# Altium schematic sheet SAMD21.SchDoc
size A
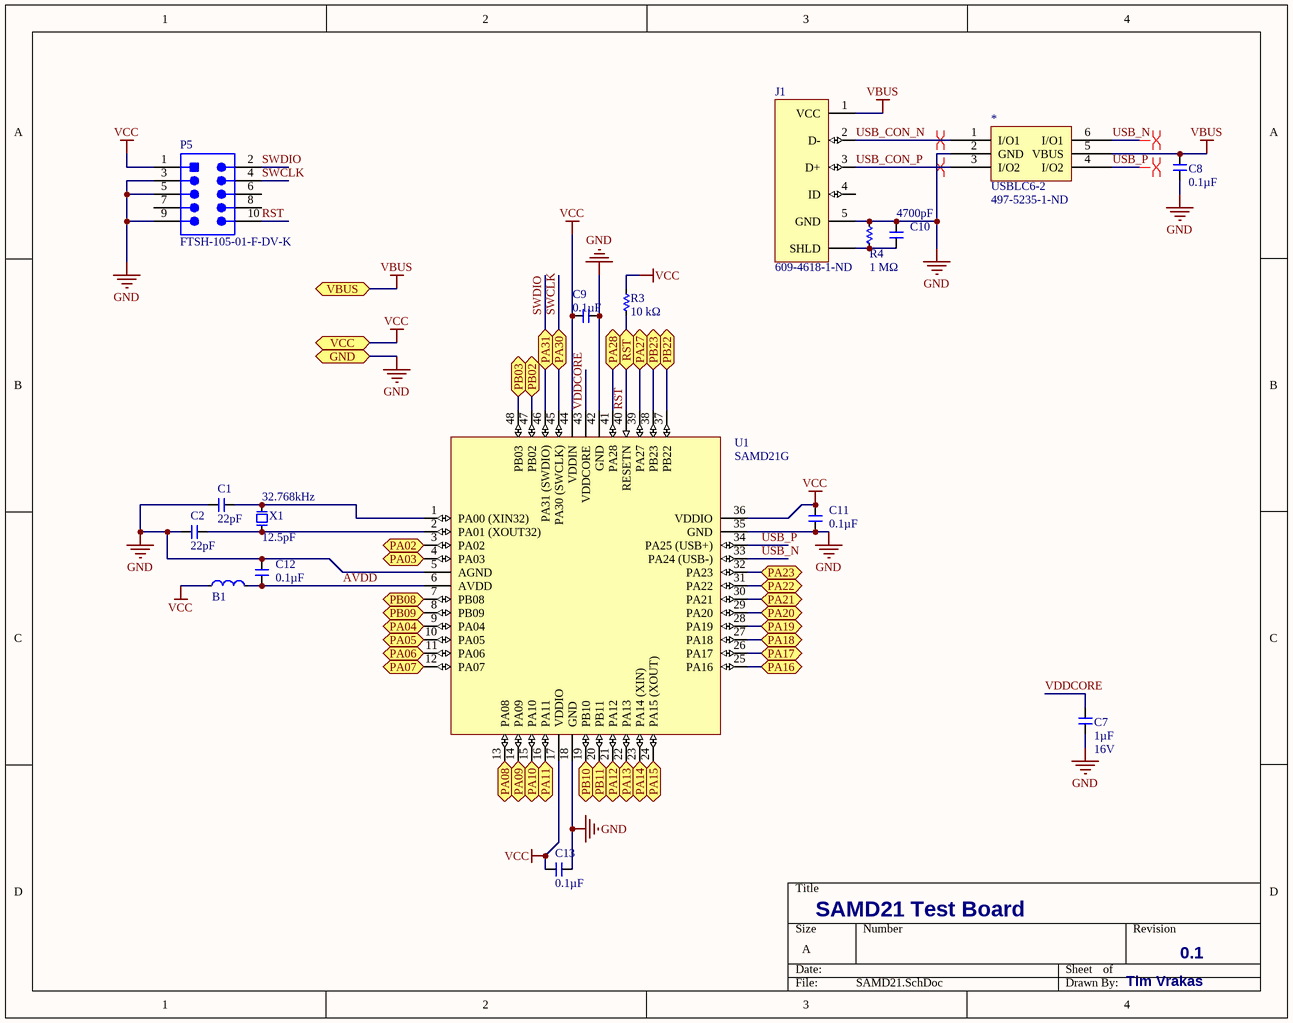
[diagram p0: SAMD21.SchDoc]

## Parts
*  USBLC6-2  Supplier Part Number 1: 497-5235-1-ND  [6SOT23]
B1  FB_1608  [R0603]  (value not drawn)
C1  Capacitance (shorthand): 22pF  [C0603]  (hidden comment: __template_cap)
C2  Capacitance (shorthand): 22pF  [C0603]  (hidden comment: __template_cap)
C7  Capacitance (shorthand): 1µF  Rated Voltage: 16V  [C0603]  (hidden comment: __template_cap)
C8  Capacitance (shorthand): 0.1µF  [C0603]  (hidden comment: __template_cap)
C9  Capacitance (shorthand): 0.1µF  [C0603]  (hidden comment: __template_cap)
C10  Capacitance (shorthand): 4700pF  [C0603]  (hidden comment: __template_cap)
C11  Capacitance (shorthand): 0.1µF  [C0603]  (hidden comment: __template_cap)
C12  Capacitance (shorthand): 0.1µF  [C0603]  (hidden comment: __template_cap)
C13  Capacitance (shorthand): 0.1µF  [C0603]  (hidden comment: __template_cap)
J1  Supplier Part Number 1: 609-4618-1-ND  [CONN_USBMICROB_10118194-0001LF]  (hidden comment: CONN_USB_MICROB_SMD_TH_R/A)
P5  FTSH-105-01-F-DV-K  [SMTC-FTSH-105-01-L-DV-K_V]
R3  Resistance: 10 kΩ  [R0603]  (hidden comment: __template_resistor)
R4  Resistance: 1 MΩ  [R0603]  (hidden comment: __template_resistor)
U1  SAMD21G  [SAMD21 TQFP-48]
X1  Frequency: 32.768kHz  Load Capacitance: 12.5pF  [XTAL_TXC_9HT10]  (hidden comment: XTAL_9HT10-32.768KEZF-T)

## Ports
GND (bidir), PA02 (bidir), PA03 (bidir), PA04 (bidir), PA05 (bidir), PA06 (bidir), PA07 (bidir), PA08 (bidir), PA09 (bidir), PA10 (bidir), PA11 (bidir), PA12 (bidir), PA13 (bidir), PA14 (bidir), PA15 (bidir), PA16 (bidir), PA17 (bidir), PA18 (bidir), PA19 (bidir), PA20 (bidir), PA21 (bidir), PA22 (bidir), PA23 (bidir), PA27 (bidir), PA28 (bidir), PA30 (bidir), PA31 (bidir), PB02 (bidir), PB03 (bidir), PB08 (bidir), PB09 (bidir), PB10 (bidir), PB11 (bidir), PB22 (bidir), PB23 (bidir), RST (bidir), VBUS (bidir), VCC (bidir)

## Nets
GND: *.2(GND) C1.1 C2.1 C7.2 C8.2 C9.1 C10.1 C11.1 C12.1 C13.2 J1.5(GND) P5.3 P5.5 P5.9 R4.2 U1.5(AGND) U1.18(GND) U1.35(GND) U1.42(GND) ; port GND
VBUS: *.5(VBUS) C8.1 J1.1(VCC) ; port VBUS
VCC: B1.1 C9.2 C11.2 C13.1 P5.1 R3.2 U1.17(VDDIO) U1.36(VDDIO) U1.44(VDDIN) ; port VCC
AVDD: B1.2 C12.2 U1.6(AVDD)
PA02: U1.3(PA02) ; port PA02
PA03: U1.4(PA03) ; port PA03
PA04: U1.9(PA04) ; port PA04
PA05: U1.10(PA05) ; port PA05
PA06: U1.11(PA06) ; port PA06
PA07: U1.12(PA07) ; port PA07
PA08: U1.13(PA08) ; port PA08
PA09: U1.14(PA09) ; port PA09
PA10: U1.15(PA10) ; port PA10
PA11: U1.16(PA11) ; port PA11
PA12: U1.21(PA12) ; port PA12
PA13: U1.22(PA13) ; port PA13
PA14: U1.23(PA14_(XIN)) ; port PA14
PA15: U1.24(PA15_(XOUT)) ; port PA15
PA16: U1.25(PA16) ; port PA16
PA17: U1.26(PA17) ; port PA17
PA18: U1.27(PA18) ; port PA18
PA19: U1.28(PA19) ; port PA19
PA20: U1.29(PA20) ; port PA20
PA21: U1.30(PA21) ; port PA21
PA22: U1.31(PA22) ; port PA22
PA23: U1.32(PA23) ; port PA23
PA27: U1.39(PA27) ; port PA27
PA28: U1.41(PA28) ; port PA28
PB02: U1.47(PB02) ; port PB02
PB03: U1.48(PB03) ; port PB03
PB08: U1.7(PB08) ; port PB08
PB09: U1.8(PB09) ; port PB09
PB10: U1.19(PB10) ; port PB10
PB11: U1.20(PB11) ; port PB11
PB22: U1.37(PB22) ; port PB22
PB23: U1.38(PB23) ; port PB23
RST: P5.10 R3.1 U1.40(RESETN) ; port RST
SWCLK: P5.4 U1.45(PA30_(SWCLK)) ; port PA30
SWDIO: P5.2 U1.46(PA31_(SWDIO)) ; port PA31
USB_CON_N: *.1(I/O1) J1.2(D-)
USB_CON_P: *.3(I/O2) J1.3(D+)
USB_N: *.6(I/O1) U1.33(PA24_(USB-))
USB_P: *.4(I/O2) U1.34(PA25_(USB+))
VDDCORE: C7.1 U1.43(VDDCORE)
NetC1_2: C1.2 U1.1(PA00_(XIN32)) X1.2
NetC2_2: C2.2 U1.2(PA01_(XOUT32)) X1.1
NetC10_2: C10.2 J1.SHIELD(SHLD) R4.1

Not connected (* = marked no-connect by the designer): J1 4(ID); P5 6 7 8

## Layout directives
differential pair: USB_CON_N, USB_CON_P, USB_N, USB_P

## Notes on the sheet
- SAMD21 Test Board
- 0.1
- Tim Vrakas

## Library data of the parts
* = USBLC6-2: Manufacturer: STMicroelectronics; Manufacturer Part Number: USBLC6-2SC6; Unidirectional Channels: 2; Voltage - Reverse Standoff (Typ): 5.25V; Voltage - Breakdown (Min): 6V; Voltage - Clamping (Max) @ Ipp: 17V; Current - Peak Pulse (10/1000µs): 5A (8/20µs); Power Line Protection: Yes; Supplier 1: Digi-Key; RoHS: RoHS Compliant; Category: Circuit Protection; Stock 1: 31719; Pricing 1: 1=0.51, 10=0.411, 100=0.2802, 500=0.21012, 1000=0.15759 (USD); Packaging: Cut Tape (CT); Part Status: Active; Type: Steering (Rail to Rail); Bidirectional Channels: -; Power - Peak Pulse: -; Applications: Ethernet; Capacitance @ Frequency: -; Operating Temperature: -40°C ~ 125°C (TJ); Mounting Type: Surface Mount; Package / Case: SOT-23-6; Supplier Device Package: SOT-23-6; ComponentLink1URL: http://www.st.com/web/en/resource/technical/document/datasheet/CD00050750.pdf; ComponentLink1Description: http://www.st.com/web/en/resource/technical/document/datasheet/CD00050750.pdf
B1 = FB_1608: FERRITE BEAD 600 OHM 300mA; Manufacturer: Taiyo Yuden; Manufacturer Part Number: BK1608HW601-T; Number of Lines: 1; Impedance @ Frequency: 600 Ohm @ 100MHz; DC Resistance (DCR) (Max): 400 mOhm; Supplier 1: Digi-Key; Supplier Part Number 1: 587-1879-1-ND; RoHS: RoHS Compliant; Category: Filters; Stock 1: 11908; Pricing 1: 1=0.1, 10=0.059, 50=0.0474, 100=0.0426, 250=0.0312, 500=0.0227, 1000=0.02223 (USD); Packaging: Cut Tape (CT); Part Status: Active; Filter Type: -; Current Rating (Max): 300mA; Ratings: -; Operating Temperature: -55°C ~ 125°C; Package / Case: 0603 (1608 Metric); Mounting Type: Surface Mount; Height (Max): 0.037" (0.95mm); Size / Dimension: 0.063" L x 0.031" W (1.60mm x 0.80mm); ComponentLink1URL: http://ds.yuden.co.jp/TYCOMPAS/ut/detail.do?productNo=BK1608HW601-T&fileName=BK1608HW601-T_SS&mode=specSheetDownload; ComponentLink1Description: http://ds.yuden.co.jp/TYCOMPAS/ut/detail.do?productNo=BK1608HW601-T&fileName=BK1608HW601-T_SS&mode=specSheetDownload
C1 C2 = CAP CER 22PF 50V C0G/NP0 0603
C7 = CAP CER 0603 1µF X7R 16V 10%: Manufacturer: Murata Electronics North America; Capacitance - pF (Machine readable): 1000000; type: capacitor; Dielectric: X7R; Supplier 1: Digikey; Supplier Part Number 1: 490-3900-1-ND
C8 C9 C11-C13 = CAP CER 0603 0.1µF X7R 50V 10%: Manufacturer: Murata Electronics North America; Capacitance - pF (Machine readable): 100000; type: capacitor; Dielectric: X7R; Supplier 1: Digikey; Supplier Part Number 1: 490-1519-1-ND
C10 = CAP CER 0603 4700pF X7R 50V 10%: Manufacturer: Murata Electronics North America; Capacitance - pF (Machine readable): 4700; type: capacitor; Dielectric: X7R; Supplier 1: Digikey; Supplier Part Number 1: 490-1506-1-ND
J1 = CONN_USB_MICROB_SMD_TH_R/A: Through Hole Micro USB Connector; Manufacturer: Amphenol FCI; Manufacturer Part Number: 10118194-0001LF; Gender: Receptacle; Current Rating: 1.8A; Connector Type: USB,Receptacle; Number of Contacts: 5; Insulation Resistance: 1GR; Number of Ports: 1; Max Voltage Rating (AC): 100V; Pitch: 0.65mm; Supplier 1: Digi-Key; Stock 1: 180464; Pricing 1: 1=0.46, 10=0.437, 25=0.3744, 50=0.318, 100=0.3056, 250=0.2744, 500=0.262 (USD); Mount: Surface Mount,Horizontal; Contact Material: Copper Alloy; Contact Plating: Nickel,Gold; Number of Terminals: 5; Housing Material: Polymer; Colour: Black; Min Operating Temperature: -55°C; Max Operating Temperature: 85°C; Package Quantity: 9600; Packaging: Tape and Reel; Termination: Solder; Orientation: Right Angle; Length: 8.05mm; Depth: 5mm; Radiation Hardening: No; Lead Free: Lead Free; Flammability Rating: UL94 V-0; ComponentLink1URL: https://datasheet.ciiva.com/851/10118194-851110.pdf; ComponentLink1Description: https://datasheet.ciiva.com/851/10118194-851110.pdf; ComponentLink2URL: https://datasheet.ciiva.com/851/10118194-851111.pdf; ComponentLink2Description: https://datasheet.ciiva.com/851/10118194-851111.pdf; ComponentLink3URL: https://datasheet.ciiva.com/4598/10118194ac-197217-4598807.pdf; ComponentLink3Description: https://datasheet.ciiva.com/4598/10118194ac-197217-4598807.pdf; ComponentLink4URL: https://datasheet.ciiva.com/29907/10118194-29907230.pdf; ComponentLink4Description: https://datasheet.ciiva.com/29907/10118194-29907230.pdf; ComponentLink5URL: https://datasheet.ciiva.com/26945/getdatasheetpartid-418619-26945695.pdf; ComponentLink5Description: https://datasheet.ciiva.com/26945/getdatasheetpartid-418619-26945695.pdf
P5 = CMP-2000-05352-1: Male Header, Pitch 1.27 mm, 2 x 5 Position, Height 6.12 mm, RoHS, Tube; Manufacturer: Samtec; Number of Positions: 10; Connector Type: Header,Shrouded; Number of Positions Loaded: All; Fastening Type: -; Package Reference: FTSH-105-01-L-DV-K; Termination: Solder; Package URL: http://suddendocs.samtec.com/prints/ftsh-1xx-xx-xxx-dv-xxx-footprint.pdf; Number of Rows: 2; Contact Finish Thickness: 3µin(0.08µm); Contact Type: MalePin; Manufacturer URL: http://www.samtec.com/; Series: FTSH; Features: -; Contact Finish: Gold; Color: Black; Family: RectangularConnectors-Headers,MalePins; Datasheet URL: http://suddendocs.samtec.com/prints/ftsh-1xx-xx-xxx-dv-xxx-mkt.pdf; Package Description: Male Header, Pitch 1.27 mm, 2 x 5 Position, Height 5.97 mm, Tail Length 4.32 mm; Mounting Type: SurfaceMount; Datasheet Version: Rev. ET, 10/1995; Category: Connectors,Interconnects; Packaging: Tube
R3 = RES SMD 10K OHM 1% 1/10W 0603: Manufacturer Part Number: RC0603FR-0710KL; Manufacturer: Yageo; Resistance (Sortable): 10000; Tolerance: ±1%; Power (Watts): 0.1W, 1/10W; Temperature Coefficient: ±100ppm/°C; Supplier 1: Digikey; Datasheets: http://www.yageo.com/documents/recent/PYu-RC_Group_51_RoHS_L_9.pdf; Image: //media.digikey.com/Renders/Yageo%20Renders/0603-(1608-Metric).jpg; Supplier Part Number 1: 311-10.0KHRCT-ND; Operating Temperature: -55°C ~ 155°C
R4 = RES SMD 1M OHM 1% 1/10W 0603: Manufacturer Part Number: RC0603FR-071ML; Manufacturer: Yageo; Resistance (Sortable): 1000000; Tolerance: ±1%; Power (Watts): 0.1W, 1/10W; Temperature Coefficient: ±100ppm/°C; Supplier 1: Digikey; Datasheets: http://www.yageo.com/documents/recent/PYu-RC_Group_51_RoHS_L_9.pdf; Image: //media.digikey.com/Renders/Yageo%20Renders/0603-(1608-Metric).jpg; Supplier Part Number 1: 311-1.00MHRCT-ND; Operating Temperature: -55°C ~ 155°C
U1 = SAMD21G: 48Mhz Atmel SAM ARM Cortex M0+; Supplier 2: Newark; Supplier 3: Future Electronics; Supplier 4: Digi-Key; Supplier 5: Future Electronics; Supplier 6: Newark; Supplier 7: Arrow; Supplier 8: Mouser; Supplier 9: Avnet; ComponentLink1Description: Product Page; ComponentLink1URL: https://www.microchip.com/wwwproducts/en/ATSAMD21G18; ComponentLink2Description: Datasheet; ComponentLink2URL: http://ww1.microchip.com/downloads/en/DeviceDoc/SAM-D21-Family-Datasheet-DS40001882C.pdf; Supplier 1: Farnell; Supplier Part Number 1: 2409248; Supplier Part Number 2: 15AC6160; Supplier Part Number 3: 7044615; Supplier Part Number 4: ATSAMD21G18A-AU-ND; Supplier Part Number 6: 45X9928; Supplier Part Number 7: ATSAMD21G18A-AU; Supplier Part Number 8: 556-ATSAMD21G18A-AU; Supplier Part Number 9: ATSAMD21G18A-AU; Supplier Part Number 5: ATSAMD21G18A-AU
X1 = XTAL_9HT10-32.768KEZF-T: CRYSTAL 32.768 KHZ 12.5 PF SMD; Manufacturer: TXC CORPORATION; Frequency Tolerance: ±10ppm; ESR (Equivalent Series Resistance): 70 kOhm; Operating Mode: Fundamental; Supplier 1: Digi-Key; Manufacturer Part Number: 9HT10-32.768KEZF-T; RoHS: RoHS Compliant; Category: Crystals and Oscillators; Stock 1: 5250; Pricing 1: 1=1.88, 10=1.625, 50=1.425, 100=1.125, 500=0.95, 1000=0.75 (USD); Type: kHz Crystal (Tuning Fork); Frequency Stability: -; Operating Temperature: -40°C ~ 85°C; Ratings: -; Mounting Type: Surface Mount; Package / Case: 2-SMD; Size / Dimension: 0.126" L x 0.059" W (3.20mm x 1.50mm); Height: 0.033" (0.85mm); Packaging: Cut Tape (CT); ComponentLink1URL: http://www.txccrystal.com/images/pdf/9ht10.pdf; ComponentLink1Description: Datasheet; Supplier Part Number 1: 887-1507-1-ND